# EAGLE design opencryptotoken (EAGLE 6.1)
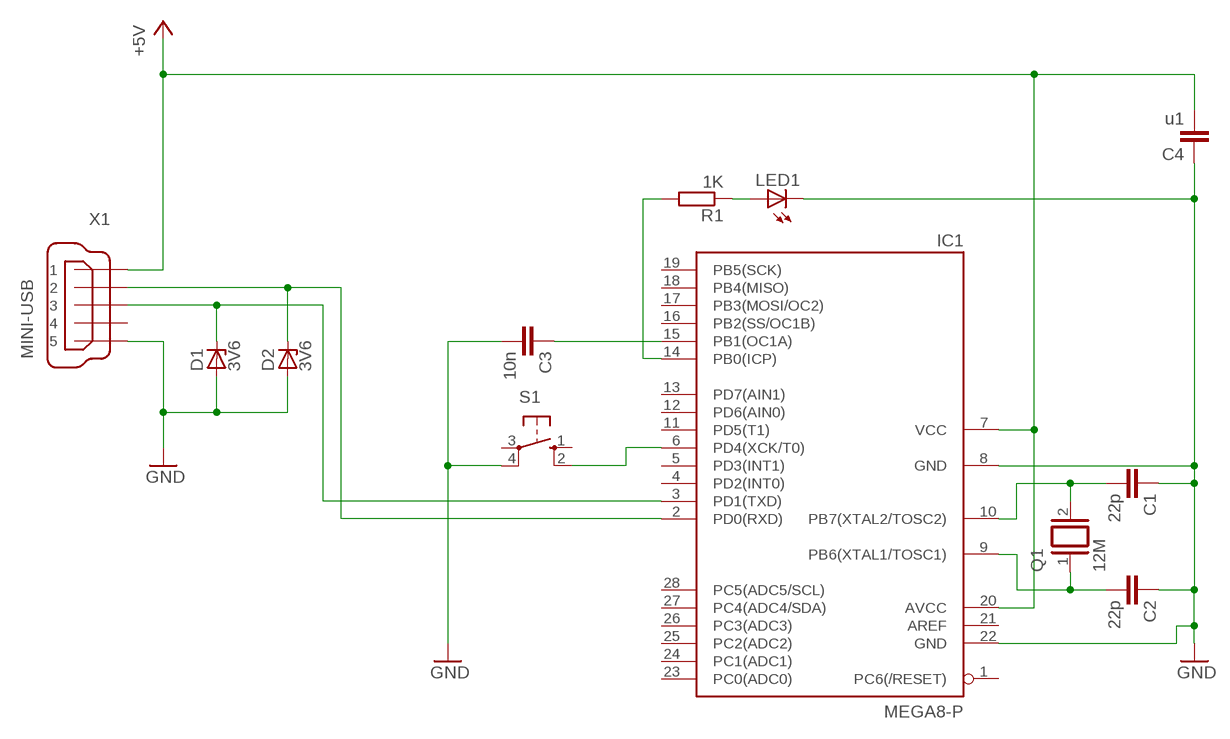
[diagram p0: schematic, sheet 1]

## Parts
C1  22p  C-EU025-024X044  [C025-024X044]
C2  22p  C-EU025-024X044  [C025-024X044]
C3  10n  C-EU025-024X044  [C025-024X044]
C4  u1  C-EU025-024X044  [C025-024X044]
D1  3V6  ZENER-DIODEZD-2.5  [ZDIO-2.5]
D2  3V6  ZENER-DIODEZD-5  [ZDIO-5]
IC1  MEGA8-P  [DIL28-3]
LED1  LED5MM  [LED5MM]
Q1  12M  XTAL/S  [QS]
R1  1K  R-EU_0204/2V  [0204V]
S1  10-XX  [B3F-10XX]
X1  MINI-USB  MINI-USB_SHIELD5P2-32005-601  [32005-601]

## Nets
+5V: C4.2 IC1.7(VCC) IC1.20(AVCC) X1.1
GND: C1.1 C2.1 C3.2 C4.1 D1.A D2.A IC1.8(GND) IC1.22(GND) LED1.K(C) S1.4(P1) X1.5
N$1: C1.2 IC1.10(PB7(XTAL2/TOSC2)) Q1.2
N$2: C2.2 IC1.9(PB6(XTAL1/TOSC1)) Q1.1
N$7: C3.1 IC1.15(PB1(OC1A))
N$8: IC1.14(PB0(ICP)) R1.2
N$9: LED1.A R1.1
N$11: D2.C IC1.2(PD0(RXD)) X1.2
N$12: D1.C IC1.3(PD1(TXD)) X1.3
N$13: IC1.6(PD4(XCK/T0)) S1.2(S1)
Unconnected: IC1.1(PC6(/RESET)) IC1.4(PD2(INT0)) IC1.5(PD3(INT1)) IC1.11(PD5(T1)) IC1.12(PD6(AIN0)) IC1.13(PD7(AIN1)) IC1.16(PB2(SS/OC1B)) IC1.17(PB3(MOSI/OC2)) IC1.18(PB4(MISO)) IC1.19(PB5(SCK)) IC1.21(AREF) IC1.23(PC0(ADC0)) IC1.24(PC1(ADC1)) IC1.25(PC2(ADC2)) IC1.26(PC3(ADC3)) IC1.27(PC4(ADC4/SDA)) IC1.28(PC5(ADC5/SCL)) S1.1(S) S1.3(P) X1.4 X1.M1(S1) X1.M2(S2)

## Library data of the parts
C1-C4 = rcl:C-EU: CAPACITOR, European symbol
D1 D2 = diode:ZENER-DIODE: Z-Diode
IC1 = atmel:MEGA8-P: MICROCONTROLLER 8 Kbytes FLASH, 1 kbytes SRAM, 512 bytes EEPROM, USART, 4-channel 10 bit ADC, 2-channel 8 bit ADC Pin compatible with Atmega48, ATMega88, ATMega168 Source: avr.lbr; OC_FARNELL: unknown; OC_NEWARK: unknown
LED1 = led:LED: LED OSRAM: - CHIPLED LG R971, LG N971, LY N971, LG Q971, LY Q971, LO R971, LY R971 LH N974, LH R974 LS Q976, LO Q976, LY Q976 LO Q996 - Hyper CHIPLED LW Q18S LB Q993, LB Q99A, LB R99A - SideLED LS A670, LO A670, LY A670, LG A670, LP A670 LB A673, LV A673, LT A673, LW A673 LH A674 LY A675 LS A676, LA A676, LO A676, LY A676, LW A676 LS A679, LY A679, LG A679 - Hyper Micro SIDELED® LS Y876, LA Y876, LO Y876, LY Y876 LT Y87S - SmartLED LW L88C, LW L88S LB L89C, LB L89S, LG L890 LS L89K, LO L89K, LY L89K LS L896, LA L896, LO L896, LY L896 - TOPLED LS T670, LO T670, LY T670, LG T670, LP T670 LSG T670, LSP T670, LSY T670, LOP T670, LYG T670 LG T671, LOG T671, LSG T671 LB T673, LV T673, LT T673, LW T673 LH T674 LS T676, LA T676, LO T676, LY T676, LB T676, LH T676, LSB T676, LW T676 LB T67C, LV T67C, LT T67C, LS T67K, LO T67K, LY T67K, LW E67C LS E67B, LA E67B, LO E67B, LY E67B, LB E67C, LV E67C, LT E67C LW T67C LS T679, LY T679, LG T679 LS T770, LO T770, LY T770, LG T770, LP T770 LB T773, LV T773, LT T773, LW T773 LH T774 LS E675, LA E675, LY E675, LS T675 LS T776, LA T776, LO T776, LY T776, LB T776 LHGB T686 LT T68C, LB T68C - Hyper Mini TOPLED® LB M676 - Mini TOPLED Santana® LG M470 LS M47K, LO M47K, LY M47K Source: http://www.osram.convergy.de LUXEON: - LUMILED® LXK2-PW12-R00, LXK2-PW12-S00, LXK2-PW14-U00, LXK2-PW14-V00 LXK2-PM12-R00, LXK2-PM12-S00, LXK2-PM14-U00 LXK2-PE12-Q00, LXK2-PE12-R00, LXK2-PE12-S00, LXK2-PE14-T00, LXK2-PE14-U00 LXK2-PB12-K00, LXK2-PB12-L00, LXK2-PB12-M00, LXK2-PB14-N00, LXK2-PB14-P00, LXK2-PB14-Q00 LXK2-PR12-L00, LXK2-PR12-M00, LXK2-PR14-Q00, LXK2-PR14-R00 LXK2-PD12-Q00, LXK2-PD12-R00, LXK2-PD12-S00 LXK2-PH12-R00, LXK2-PH12-S00 LXK2-PL12-P00, LXK2-PL12-Q00, LXK2-PL12-R00 Source: www.luxeon.com KINGBRIGHT: KA-3528ASYC Source: www.kingbright.com
Q1 = special:XTAL/S: CRYSTAL
R1 = rcl:R-EU_: RESISTOR, European symbol
S1 = switch-omron:10-XX: OMRON SWITCH; MPN: B3F-1000; OC_FARNELL: 176432; OC_NEWARK: 36M3542
X1 = con-cypressindustries:MINI-USB_SHIELD5P2-: MINI USB-B R/A DIP 5pol. Source: www.cypressindustries.com; OC_FARNELL: unknown; OC_NEWARK: unknown

## Board
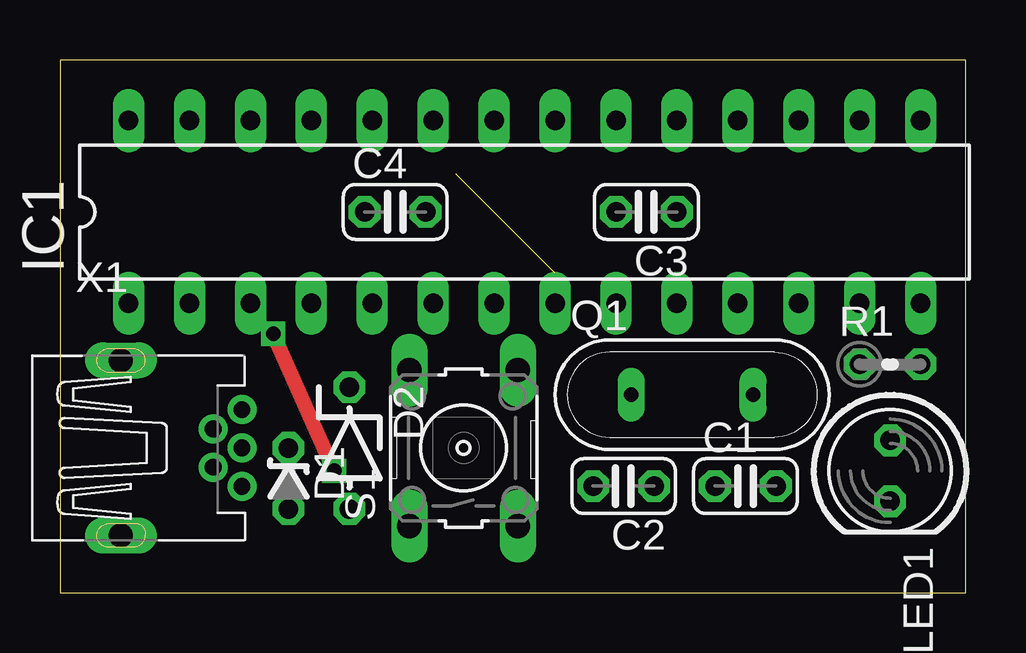
[diagram p1: board, top side]
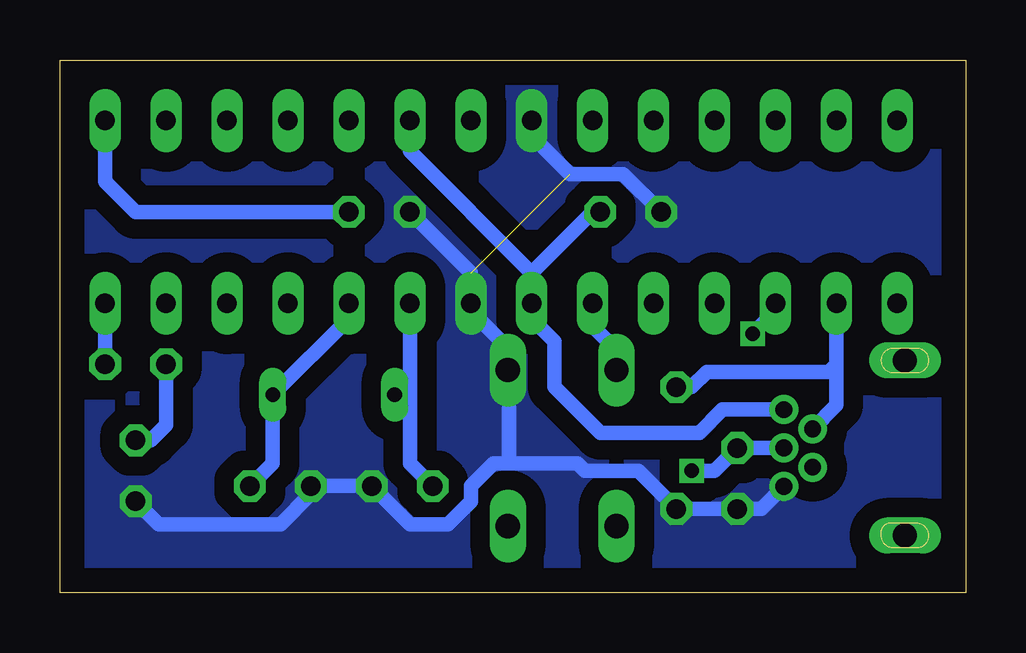
[diagram p2: board, bottom side, seen from below]

Size 37.76 x 22.21 mm. Coordinates in mm from the lower left corner, seen from the top.
Outline: 0,0 37.76,0 37.76,22.21 0,22.21 0,0
Copper layers (1*16): Top 0.035mm / dielectric 1.5mm / Bottom 0.035mm
Design rules: minimum track width 10mil, minimum drill 24mil, track to track 8mil, track to pad 8mil, pad to pad 8mil, via to via 8mil, smd to smd 8mil, copper to edge 40mil, drill to drill 8mil, minimum pad ring 10mil, minimum via ring 8mil, stop-mask expansion 4mil, vias tented up to drill 0mil, thermal gap 10mil

### Footprints (pad centres in the part's own frame; a part is rotated, then mirrored left to right if it is on the bottom)
C025-024X044 = drill 0.813 octagon: 1 -1.27,0; 2 1.27,0
ZDIO-2.5 = drill 0.813 octagon: A 1.27,0; C -1.27,0
ZDIO-5 = drill 0.813 octagon: A 2.54,0; C -2.54,0
DIL28-3 = drill 0.813 long: 1 -16.51,-3.81; 2 -13.97,-3.81; 3 -11.43,-3.81; 4 -8.89,-3.81; 5 -6.35,-3.81; 6 -3.81,-3.81; 7 -1.27,-3.81; 8 1.27,-3.81; 9 3.81,-3.81; 10 6.35,-3.81; 11 8.89,-3.81; 12 11.43,-3.81; 13 13.97,-3.81; 14 16.51,-3.81; 15 16.51,3.81; 16 13.97,3.81; 17 11.43,3.81; 18 8.89,3.81; 19 6.35,3.81; 20 3.81,3.81; 21 1.27,3.81; 22 -1.27,3.81; 23 -3.81,3.81; 24 -6.35,3.81; 25 -8.89,3.81; 26 -11.43,3.81; 27 -13.97,3.81; 28 -16.51,3.81
LED5MM = drill 0.813 octagon: A -1.27,0; K 1.27,0
QS = drill 0.61 long: 1 -2.54,0; 2 2.54,0
0204V = drill 0.813 octagon: 1 -1.27,0; 2 1.27,0
B3F-10XX = drill 1.016 long: 1 -3.251,2.261; 2 3.251,2.261; 3 -3.251,-2.261; 4 3.251,-2.261
32005-601 = drill 0.7 pad 1.016: 1 2.825,1.6; 2 1.625,0.8; 3 2.825,0; 4 1.625,-0.8; 5 2.825,-1.6 | drill 1 pad 1.422 long: M1 -2.225,3.65; M2 -2.225,-3.65

### Placement (x,y rotation side)
C1  28.57,4.45 0 top
C2  23.5,4.45 180 top
C3  24.45,15.88 180 top
C4  13.97,15.88 0 top
D1  9.52,4.76 270 top
D2  12.06,6.03 270 top
IC1  19.37,15.88 0 top
LED1  34.61,5.08 270 top
Q1  26.35,8.26 0 top
R1  34.61,9.53 0 top
S1  16.83,6.03 90 top
X1  4.76,6.03 0 top

### Tracks (layer width: path | path; a pad name or v marks a point on that pad's centre or on a via)
+5V
  Bottom 0.61: X1.1 10.15,7.63 11.11,6.67 15.24,6.67 17.15,8.57 17.15,10.48 18.1,11.43 IC1.7 18.1,13.34 | IC1.20 23.18,18.42 18.1,13.34 | C4.2 15.56,15.87 18.1,13.34
GND  (1 unrouted)
  Bottom 0.61: LED1.K 33.66,2.86 28.57,2.86 27.31,4.13 C1.1 C2.1 23.18,2.86 21.59,2.86 20.64,3.81 20.64,4.45 19.68,5.4 19.05,5.4 | 20.64,11.43 IC1.8 | IC1.8 20.64,11.75 19.05,10.16 19.05,9.32 S1.4 19.05,9.25 19.05,5.4 | X1.5 8.53,3.49 D1.A D2.A 13.65,5.08 13.97,5.08 15.24,5.08 15.88,5.08 16.19,5.4 19.05,5.4 | C3.2 20.64,13.34 IC1.8 | C4.1 14.29,17.46 16.51,17.46 18.1,19.05 IC1.22
  pour Bottom (isolate 0.813, no thermals): 0,22.22 0,0 37.78,0 37.78,22.22
N$1
  Bottom 0.61: C1.2 28.89,5.4 Q1.2 25.72,11.43 IC1.10
N$2
  Bottom 0.61: IC1.9 23.18,8.26 | 23.18,8.26 23.18,5.4 C2.2 | Q1.1 23.18,8.26
N$7
  Bottom 0.61: C3.1 34.61,15.87 35.88,17.15 IC1.15
N$8
  Bottom 0.61: IC1.14 R1.2
N$9
  Bottom 0.61: R1.1 33.34,6.99 33.97,6.35 LED1.A
N$11
  Bottom 0.61: IC1.2 5.4,9.52 | 5.4,9.52 5.4,7.82 X1.2 | D2.C 11.43,8.57 10.8,9.21 5.72,9.21 5.4,9.52
N$12  (via drill 0.6)
  Top 0.61: v11.43,5.08 v8.89,10.79
  Bottom 0.61: X1.3 D1.C 10.48,5.08 v11.43,5.08 | v8.89,10.79 7.94,11.75 IC1.3
N$13
  Bottom 0.61: S1.2 14.57,10.12 15.56,11.11 IC1.6